# EasyEDA schematic Bravo-M1-Clock-and-Program Counter.json

## Sheets
1 Bravo-M1-Program Counter: TITLE: Bravo V1.0-M1-Program Counter; REV: 1.0; Date: 2021-11-22; Sheet: 1/3; Drawn By: Kaveh Majidi (CONFIG IOI)
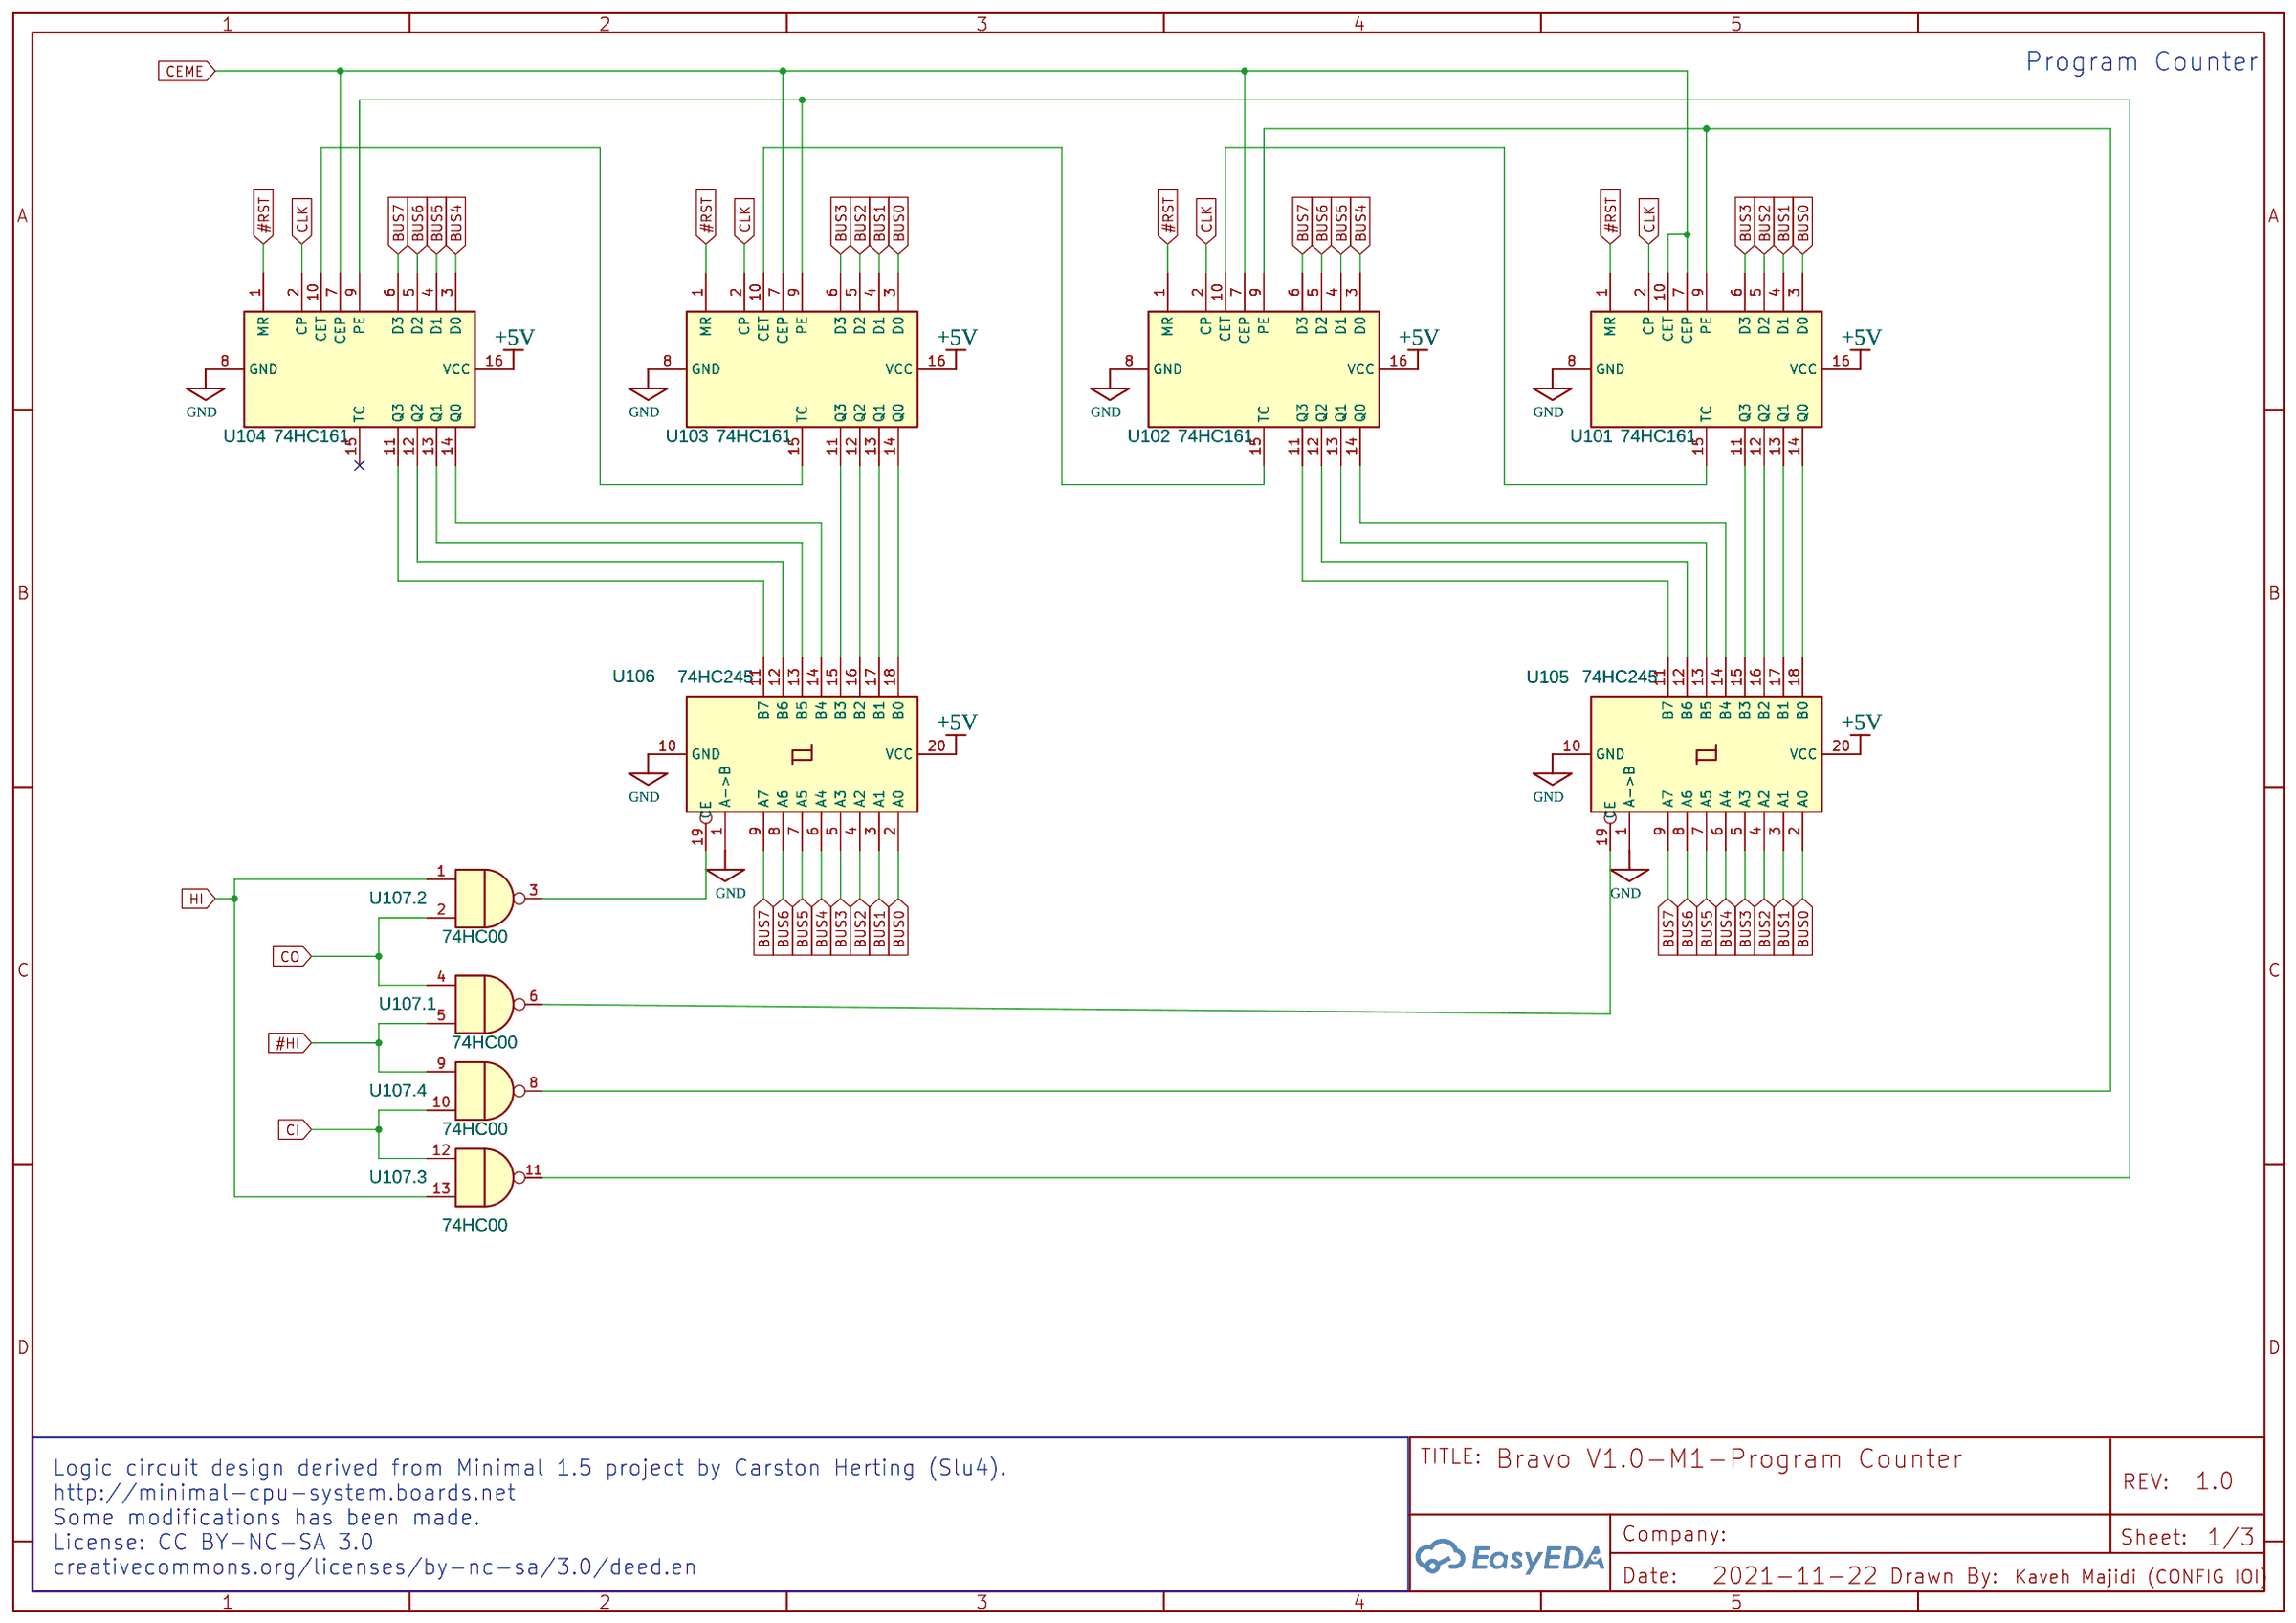
[diagram p0: Bravo-M1-Program Counter]
2 Bravo-M1-Common: TITLE: Bravo V1.0-M1-Common; Date: 2021-11-23; Sheet: 3/3
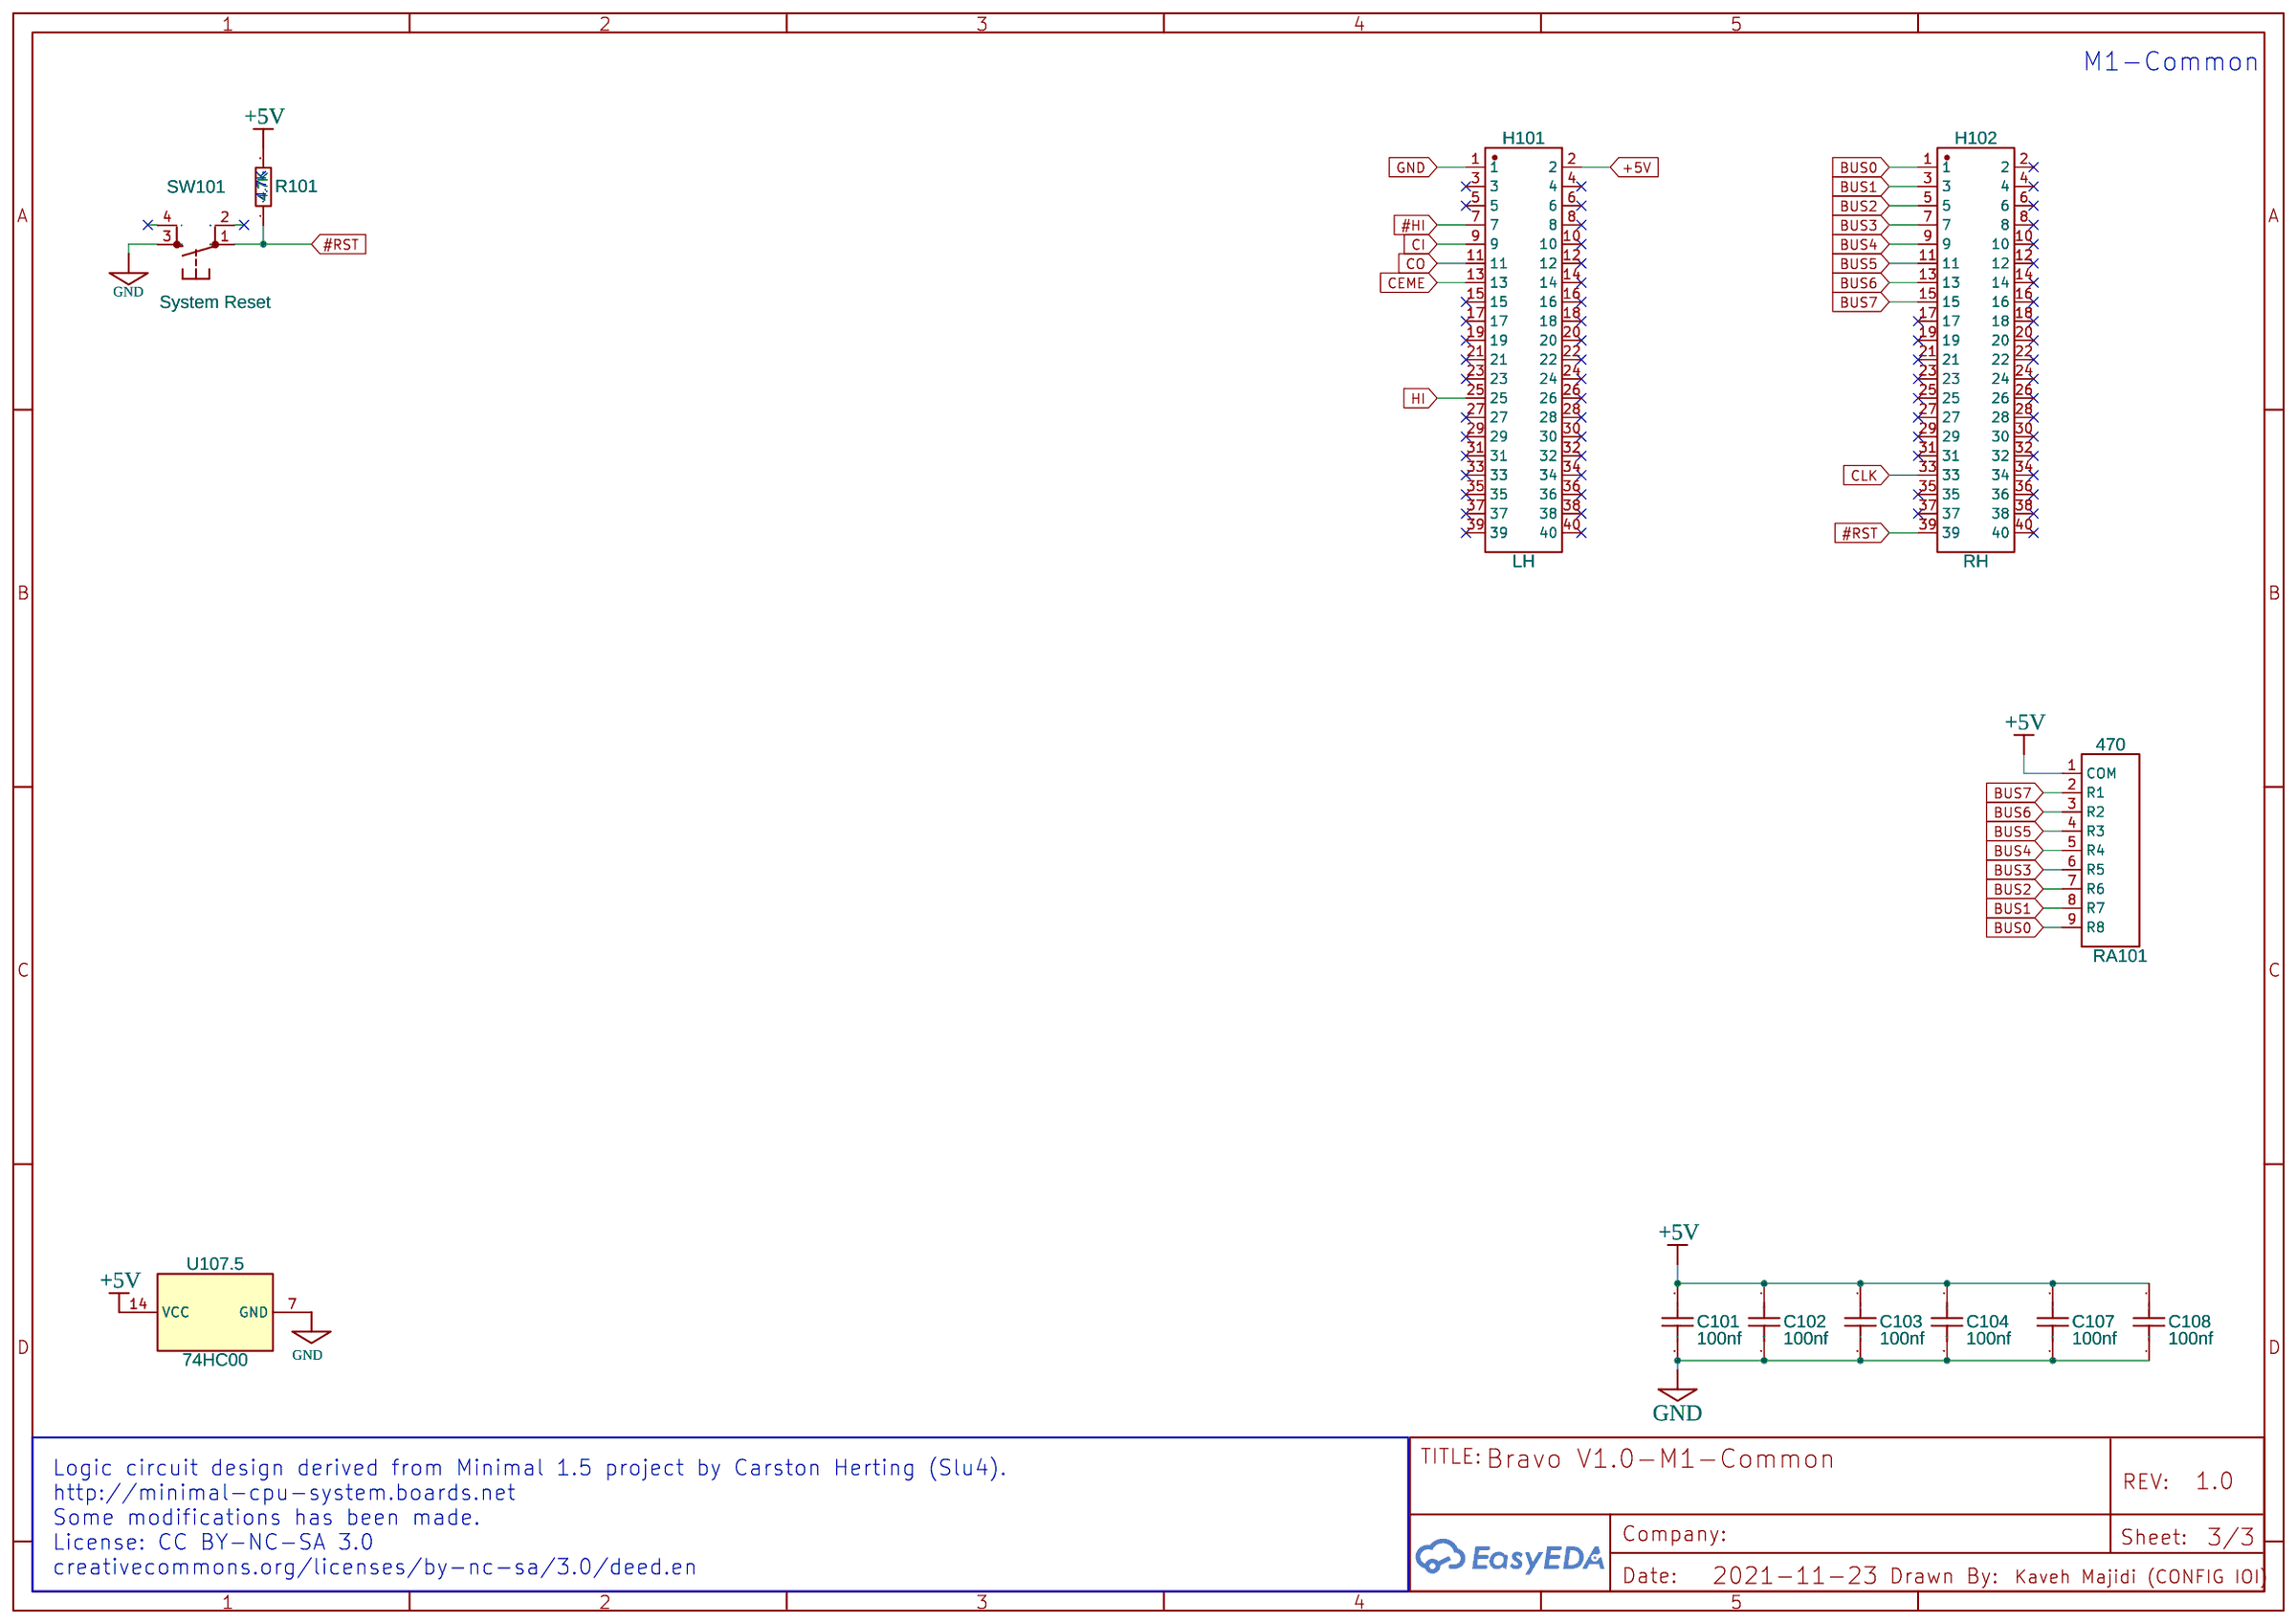
[diagram p1: Bravo-M1-Common]
3 Bravo-M1-Clock: TITLE: Bravo V1.0-M1-Clock; Date: 2021-11-23; Sheet: 2/3
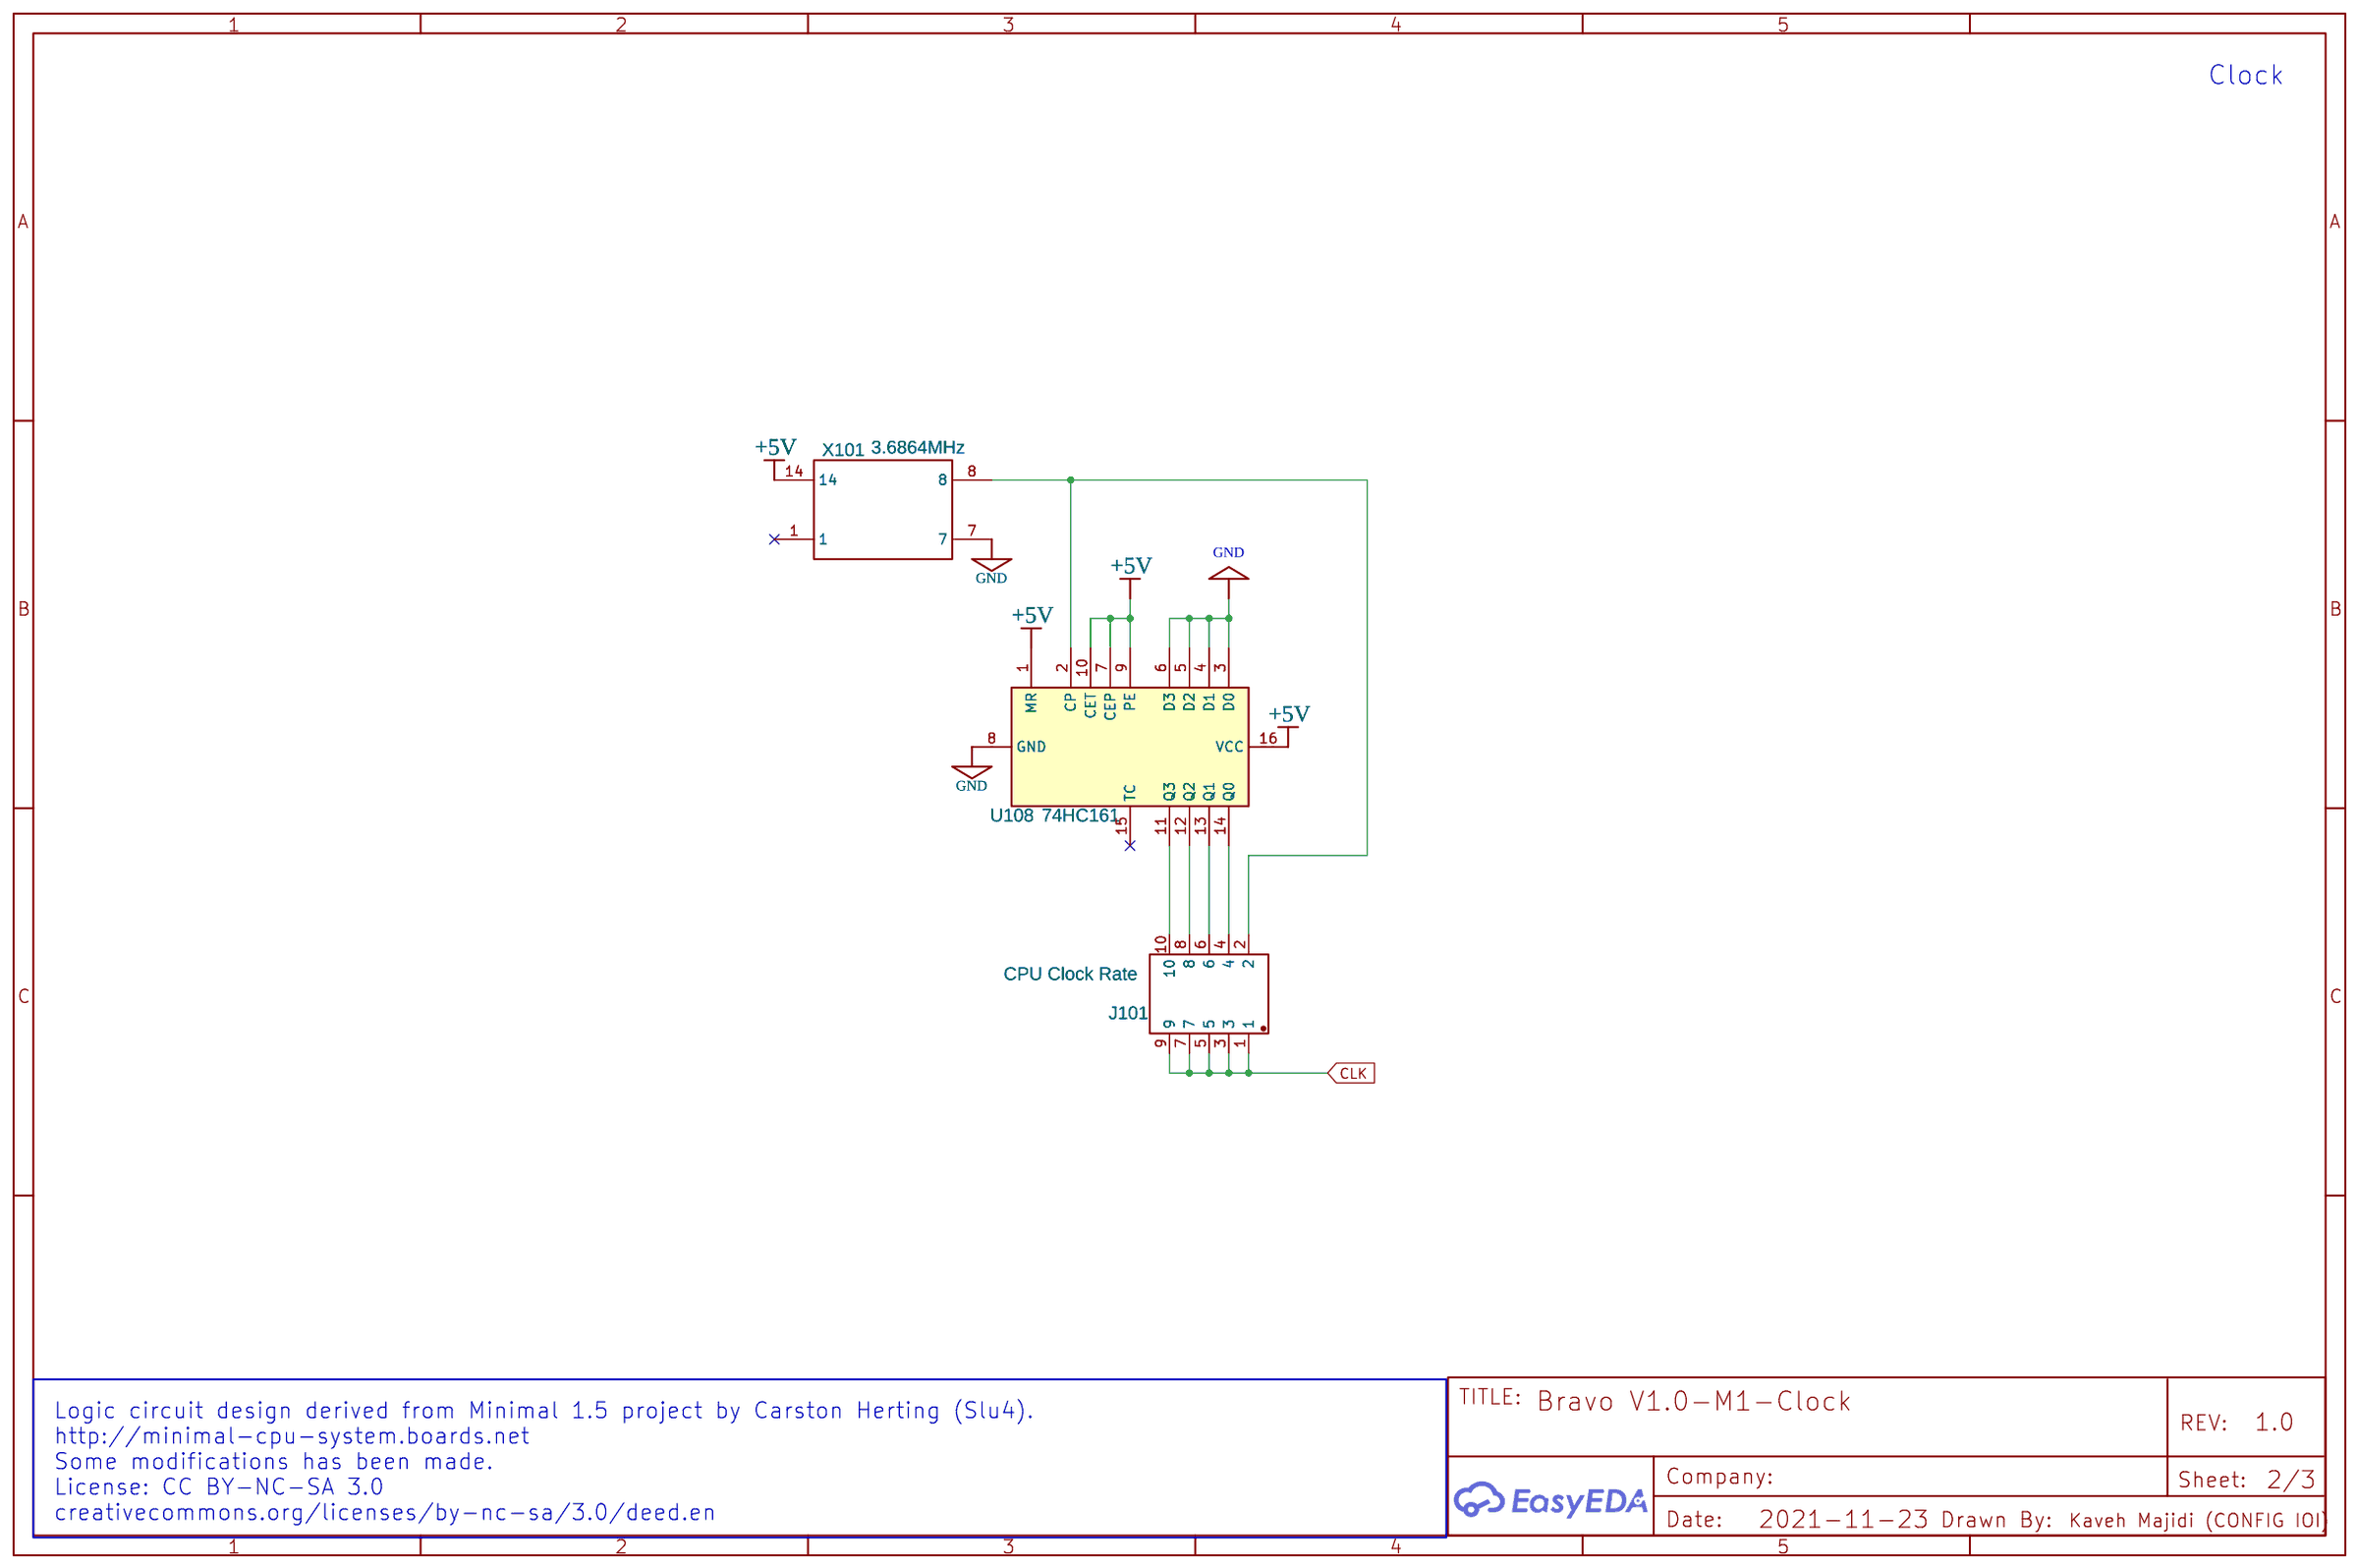
[diagram p2: Bravo-M1-Clock]

## Parts
sheet Bravo-M1-Clock
J101  CPU Clock Rate  [HDR-TH_10P-P2.54-V-R2-C5-S2.54_MTP125-1205S1]
U108  74HC161  [DIP-16_W7.62MM_SOCKET]
X101  3.6864MHz  [CRYSTAL 1MHZ]
sheet Bravo-M1-Common
C101  100nf  [CAP-TH_L4.0-W2.5-P5.00-D1.0]
C102  100nf  [CAP-TH_L4.0-W2.5-P5.00-D1.0]
C103  100nf  [CAP-TH_L4.0-W2.5-P5.00-D1.0]
C104  100nf  [CAP-TH_L4.0-W2.5-P5.00-D1.0]
C107  100nf  [CAP-TH_L4.0-W2.5-P5.00-D1.0]
C108  100nf  [CAP-TH_L4.0-W2.5-P5.00-D1.0]
H101  LH  [HEADER-2X20-2.54]
H102  RH  [HEADER-2X20-2.54]
R101  4.7K  [AXIAL-0.4]
RA101  470  [HDR-M-2.54_1X9]
SW101  System Reset  [TACTILE-PTH]
sheet Bravo-M1-Program Counter
U101  74HC161  [DIP-16_W7.62MM_SOCKET]
U102  74HC161  [DIP-16_W7.62MM_SOCKET]
U103  74HC161  [DIP-16_W7.62MM_SOCKET]
U104  74HC161  [DIP-16_W7.62MM_SOCKET]
U105  74HC245  [DIP-20-2.54MM]
U106  74HC245  [DIP-20-2.54MM]
U107  74HC00  [DIP-14_W7.62MM_SOCKET]  (sections 1,2,3,4,5)

## Library data of the parts
J101 = 2X5: Supplier: LCSC; Supplier Part: C358694; Manufacturer: MINTRON; Manufacturer Part: MTP125-1205S1; Contributor: cmacarthur; link: https://lcsc.com/product-detail/Pin-Header-Female-Header_MINTRON-MTP125-1205S1_C358694.html
U101-U104 U108 = 74HC161: Contributor: Thiago Mendes
X101 = crystal 4 pin: Contributor: Alex1987
C101-C104 C107 C108 = CC45SL3AD220JYVNA: Supplier: LCSC; Supplier Part: C342429; Manufacturer: TDK; Contributor: LCSC
H101 H102 = HEADER-2x20-2.54: Manufacturer Part: Headers  Pins2.54mm1*10P; image: http://image.lceda.cn/szlcsc/C57369.jpg; Supplier Part: C57369; Contributor: panasonic-spunt
R101 = MF1/4W-10Ω±1% T52: Supplier: LCSC; Supplier Part: C119282; Manufacturer: Chian Chia Elec; Contributor: LCSC
RA101 = Resistor Array 8: Contributor: shubhankar1991
SW101 = TAC_SWITCH: Contributor: SparkFun
U105 U106 = 74HC245: Contributor: Andrew Fox
U107 = 74HC00: Contributor: JohnH1234; subpart_no: 1

## Nets
+5V: C101.1 C102.1 C103.1 C104.1 C107.1 C108.1 H101.2 R101.2 RA101.1(COM) U101.16(VCC) U102.16(VCC) U103.16(VCC) U104.16(VCC) U105.20(VCC) U106.20(VCC) U107.14(VCC) U108.1(MR) U108.7(CEP) U108.9(PE) U108.10(CET) U108.16(VCC) X101.14
GND: C101.2 C102.2 C103.2 C104.2 C107.2 C108.2 H101.1 SW101.3 U101.8(GND) U102.8(GND) U103.8(GND) U104.8(GND) U105.1(A->B) U105.10(GND) U106.1(A->B) U106.10(GND) U107.7(GND) U108.3(D0) U108.4(D1) U108.5(D2) U108.6(D3) U108.8(GND) X101.7
#HI: H101.7 U107.5 U107.9
#RST: H102.39 R101.1 SW101.1 U101.1(MR) U102.1(MR) U103.1(MR) U104.1(MR)
BUS0: H102.1 RA101.9(R8) U101.3(D0) U103.3(D0) U105.2(A0) U106.2(A0)
BUS1: H102.3 RA101.8(R7) U101.4(D1) U103.4(D1) U105.3(A1) U106.3(A1)
BUS2: H102.5 RA101.7(R6) U101.5(D2) U103.5(D2) U105.4(A2) U106.4(A2)
BUS3: H102.7 RA101.6(R5) U101.6(D3) U103.6(D3) U105.5(A3) U106.5(A3)
BUS4: H102.9 RA101.5(R4) U102.3(D0) U104.3(D0) U105.6(A4) U106.6(A4)
BUS5: H102.11 RA101.4(R3) U102.4(D1) U104.4(D1) U105.7(A5) U106.7(A5)
BUS6: H102.13 RA101.3(R2) U102.5(D2) U104.5(D2) U105.8(A6) U106.8(A6)
BUS7: H102.15 RA101.2(R1) U102.6(D3) U104.6(D3) U105.9(A7) U106.9(A7)
CEME: H101.13 U101.7(CEP) U101.10(CET) U102.7(CEP) U103.7(CEP) U104.7(CEP)
CI: H101.9 U107.10 U107.12
CLK: H102.33 J101.1 J101.3 J101.5 J101.7 J101.9 U101.2(CP) U102.2(CP) U103.2(CP) U104.2(CP)
CO: H101.11 U107.2 U107.4
HI: H101.25 U107.1 U107.13
Net-(J101-2): J101.2 U108.2(CP) X101.8
Net-(J101-4): J101.4 U108.14(Q0)
Net-(J101-6): J101.6 U108.13(Q1)
Net-(J101-8): J101.8 U108.12(Q2)
Net-(J101-10): J101.10 U108.11(Q3)
Net-(U101-9): U101.9(PE) U102.9(PE) U107.8
Net-(U101-11): U101.11(Q3) U105.15(B3)
Net-(U101-12): U101.12(Q2) U105.16(B2)
Net-(U101-13): U101.13(Q1) U105.17(B1)
Net-(U101-14): U101.14(Q0) U105.18(B0)
Net-(U101-15): U101.15(TC) U102.10(CET)
Net-(U102-11): U102.11(Q3) U105.11(B7)
Net-(U102-12): U102.12(Q2) U105.12(B6)
Net-(U102-13): U102.13(Q1) U105.13(B5)
Net-(U102-14): U102.14(Q0) U105.14(B4)
Net-(U102-15): U102.15(TC) U103.10(CET)
Net-(U103-9): U103.9(PE) U104.9(PE) U107.11
Net-(U103-11): U103.11(Q3) U106.15(B3)
Net-(U103-12): U103.12(Q2) U106.16(B2)
Net-(U103-13): U103.13(Q1) U106.17(B1)
Net-(U103-14): U103.14(Q0) U106.18(B0)
Net-(U103-15): U103.15(TC) U104.10(CET)
Net-(U104-11): U104.11(Q3) U106.11(B7)
Net-(U104-12): U104.12(Q2) U106.12(B6)
Net-(U104-13): U104.13(Q1) U106.13(B5)
Net-(U104-14): U104.14(Q0) U106.14(B4)
Net-(U105-19): U105.19(CE) U107.6
Net-(U106-19): U106.19(CE) U107.3

Not connected (* = marked no-connect by the designer): H101 3* 4* 5* 6* 8* 10* 12* 14* 15* 16* 17* 18* 19* 20* 21* 22* 23* 24* 26* 27* 28* 29* 30* 31* 32* 33* 34* 35* 36* 37* 38* 39* 40*; H102 2* 4* 6* 8* 10* 12* 14* 16* 17* 18* 19* 20* 21* 22* 23* 24* 25* 26* 27* 28* 29* 30* 31* 32* 34* 35* 36* 37* 38* 40*; SW101 2 4; U104 15(TC)*; U108 15(TC)*; X101 1*

## Notes on the sheets
sheet 1
- Program Counter
- Logic circuit design derived from Minimal 1.5 project by Carston Herting (Slu4).
  http://minimal-cpu-system.boards.net
  Some modifications has been made.
  License: CC BY-NC-SA 3.0
  creativecommons.org/licenses/by-nc-sa/3.0/deed.en
sheet 2
- M1-Common
- 4.7K
- Logic circuit design derived from Minimal 1.5 project by Carston Herting (Slu4).
  http://minimal-cpu-system.boards.net
  Some modifications has been made.
  License: CC BY-NC-SA 3.0
  creativecommons.org/licenses/by-nc-sa/3.0/deed.en
sheet 3
- Clock
- Logic circuit design derived from Minimal 1.5 project by Carston Herting (Slu4).
  http://minimal-cpu-system.boards.net
  Some modifications has been made.
  License: CC BY-NC-SA 3.0
  creativecommons.org/licenses/by-nc-sa/3.0/deed.en
